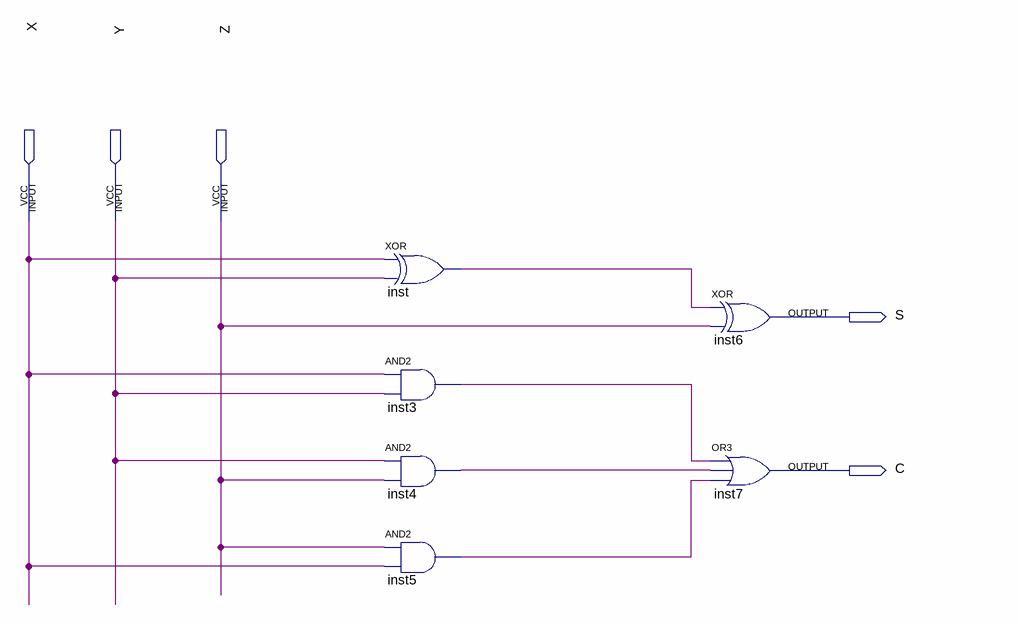
[diagram p0: schematic sheet]
// Quartus schematic FullAdder.bdf as structural Verilog: 6 symbols, 5 pins
module FullAdder (
  input  X,
  input  Y,
  input  Z,
  output S,
  output C
);

  wire inst3_out, inst4_out, inst5_out, inst_out;

  xor inst (inst_out, X, Y);
  and inst3 (inst3_out, X, Y);
  and inst4 (inst4_out, Y, Z);
  and inst5 (inst5_out, Z, X);
  xor inst6 (S, inst_out, Z);
  or inst7 (C, inst3_out, inst4_out, inst5_out);
endmodule
